# EAGLE design dac-eval (EAGLE 7.3.0)
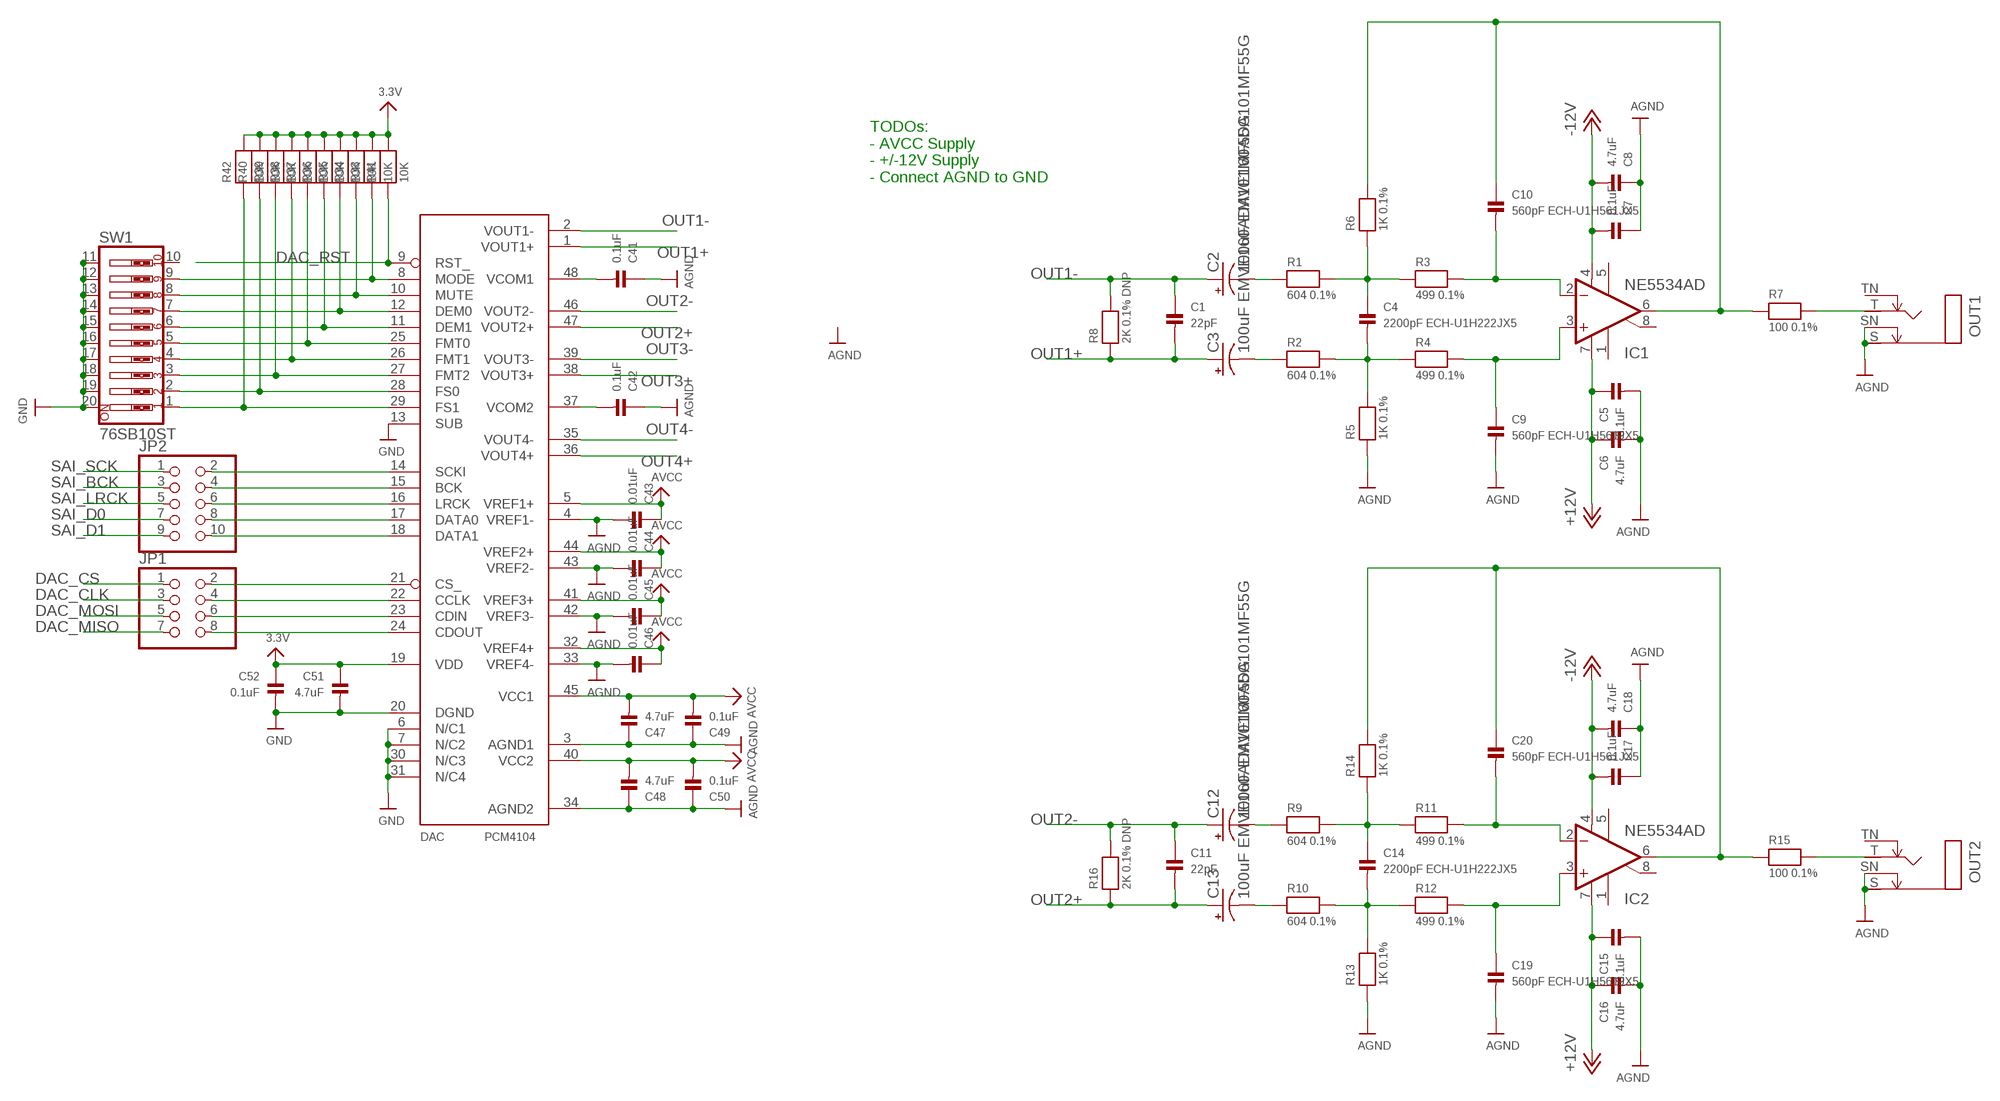
[diagram p0: schematic, sheet 1, part 1 of 2]
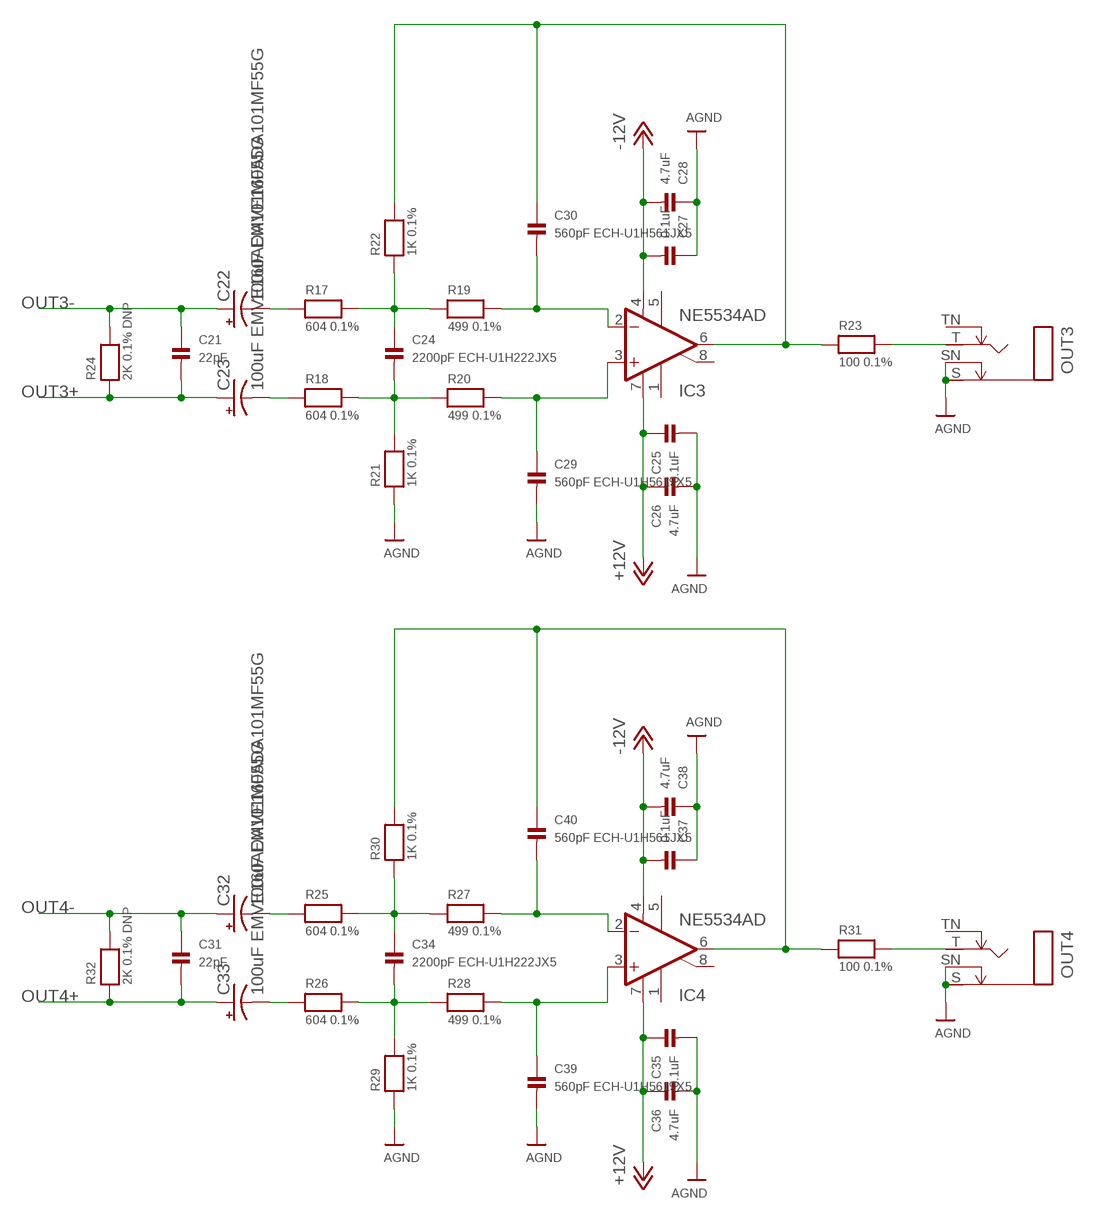
[diagram p1: schematic, sheet 1, part 2 of 2]

## Parts
C1  22pF  CAP_CERAMIC0603  [0603]
C2  100uF EMVE160ADA101MF55G  CAP_POLD  [PANASONIC_D]
C3  100uF EMVE160ADA101MF55G  CAP_POLD  [PANASONIC_D]
C4  2200pF ECH-U1H222JX5  CAP_CERAMIC0805  [0805]
C5  0.1uF  CAP_CERAMIC0603  [0603]
C6  4.7uF  CAP_CERAMIC0603  [0603]
C7  0.1uF  CAP_CERAMIC0603  [0603]
C8  4.7uF  CAP_CERAMIC0603  [0603]
C9  560pF ECH-U1H561JX5  CAP_CERAMIC0805  [0805]
C10  560pF ECH-U1H561JX5  CAP_CERAMIC0805  [0805]
C11  22pF  CAP_CERAMIC0603  [0603]
C12  100uF EMVE160ADA101MF55G  CAP_POLD  [PANASONIC_D]
C13  100uF EMVE160ADA101MF55G  CAP_POLD  [PANASONIC_D]
C14  2200pF ECH-U1H222JX5  CAP_CERAMIC0805  [0805]
C15  0.1uF  CAP_CERAMIC0603  [0603]
C16  4.7uF  CAP_CERAMIC0603  [0603]
C17  0.1uF  CAP_CERAMIC0603  [0603]
C18  4.7uF  CAP_CERAMIC0603  [0603]
C19  560pF ECH-U1H561JX5  CAP_CERAMIC0805  [0805]
C20  560pF ECH-U1H561JX5  CAP_CERAMIC0805  [0805]
C21  22pF  CAP_CERAMIC0603  [0603]
C22  100uF EMVE160ADA101MF55G  CAP_POLD  [PANASONIC_D]
C23  100uF EMVE160ADA101MF55G  CAP_POLD  [PANASONIC_D]
C24  2200pF ECH-U1H222JX5  CAP_CERAMIC0805  [0805]
C25  0.1uF  CAP_CERAMIC0603  [0603]
C26  4.7uF  CAP_CERAMIC0603  [0603]
C27  0.1uF  CAP_CERAMIC0603  [0603]
C28  4.7uF  CAP_CERAMIC0603  [0603]
C29  560pF ECH-U1H561JX5  CAP_CERAMIC0805  [0805]
C30  560pF ECH-U1H561JX5  CAP_CERAMIC0805  [0805]
C31  22pF  CAP_CERAMIC0603  [0603]
C32  100uF EMVE160ADA101MF55G  CAP_POLD  [PANASONIC_D]
C33  100uF EMVE160ADA101MF55G  CAP_POLD  [PANASONIC_D]
C34  2200pF ECH-U1H222JX5  CAP_CERAMIC0805  [0805]
C35  0.1uF  CAP_CERAMIC0603  [0603]
C36  4.7uF  CAP_CERAMIC0603  [0603]
C37  0.1uF  CAP_CERAMIC0603  [0603]
C38  4.7uF  CAP_CERAMIC0603  [0603]
C39  560pF ECH-U1H561JX5  CAP_CERAMIC0805  [0805]
C40  560pF ECH-U1H561JX5  CAP_CERAMIC0805  [0805]
C41  0.1uF  CAP_CERAMIC0603  [0603]
C42  0.1uF  CAP_CERAMIC0603  [0603]
C43  0.01uF  CAP_CERAMIC0603  [0603]
C44  0.01uF  CAP_CERAMIC0603  [0603]
C45  0.01uF  CAP_CERAMIC0603  [0603]
C46  0.01uF  CAP_CERAMIC0603  [0603]
C47  4.7uF  CAP_CERAMIC0603  [0603]
C48  4.7uF  CAP_CERAMIC0603  [0603]
C49  0.1uF  CAP_CERAMIC0603  [0603]
C50  0.1uF  CAP_CERAMIC0603  [0603]
C51  4.7uF  CAP_CERAMIC0603  [0603]
C52  0.1uF  CAP_CERAMIC0603  [0603]
DAC  PCM4104  [SQFP-S-7X7-48]
IC1  NE5534AD  [SO08]
IC2  NE5534AD  [SO08]
IC3  NE5534AD  [SO08]
IC4  NE5534AD  [SO08]
JP1  PINHD-2X4  [2X04]
JP2  PINHD-2X5  [2X05]
OUT1  NMJ4HFD2  MONOSWS  [NMJ4HC-S]
OUT2  NMJ4HFD2  MONOSWS  [NMJ4HC-S]
OUT3  NMJ4HFD2  MONOSWS  [NMJ4HC-S]
OUT4  NMJ4HFD2  MONOSWS  [NMJ4HC-S]
R1  604 0.1%  RESISTOR0603  [0603]
R2  604 0.1%  RESISTOR0603  [0603]
R3  499 0.1%  RESISTOR0603  [0603]
R4  499 0.1%  RESISTOR0603  [0603]
R5  1K 0.1%  RESISTOR0603  [0603]
R6  1K 0.1%  RESISTOR0603  [0603]
R7  100 0.1%  RESISTOR0603  [0603]
R8  2K 0.1% DNP  RESISTOR0603  [0603]
R9  604 0.1%  RESISTOR0603  [0603]
R10  604 0.1%  RESISTOR0603  [0603]
R11  499 0.1%  RESISTOR0603  [0603]
R12  499 0.1%  RESISTOR0603  [0603]
R13  1K 0.1%  RESISTOR0603  [0603]
R14  1K 0.1%  RESISTOR0603  [0603]
R15  100 0.1%  RESISTOR0603  [0603]
R16  2K 0.1% DNP  RESISTOR0603  [0603]
R17  604 0.1%  RESISTOR0603  [0603]
R18  604 0.1%  RESISTOR0603  [0603]
R19  499 0.1%  RESISTOR0603  [0603]
R20  499 0.1%  RESISTOR0603  [0603]
R21  1K 0.1%  RESISTOR0603  [0603]
R22  1K 0.1%  RESISTOR0603  [0603]
R23  100 0.1%  RESISTOR0603  [0603]
R24  2K 0.1% DNP  RESISTOR0603  [0603]
R25  604 0.1%  RESISTOR0603  [0603]
R26  604 0.1%  RESISTOR0603  [0603]
R27  499 0.1%  RESISTOR0603  [0603]
R28  499 0.1%  RESISTOR0603  [0603]
R29  1K 0.1%  RESISTOR0603  [0603]
R30  1K 0.1%  RESISTOR0603  [0603]
R31  100 0.1%  RESISTOR0603  [0603]
R32  2K 0.1% DNP  RESISTOR0603  [0603]
R33  10K  RESISTOR0603  [0603]
R34  10K  RESISTOR0603  [0603]
R35  10K  RESISTOR0603  [0603]
R36  10K  RESISTOR0603  [0603]
R37  10K  RESISTOR0603  [0603]
R38  10K  RESISTOR0603  [0603]
R39  10K  RESISTOR0603  [0603]
R40  10K  RESISTOR0603  [0603]
R41  10K  RESISTOR0603  [0603]
R42  10K  RESISTOR0603  [0603]
SW1  76SB10ST  SW_DIP-10  [EDG-10]

## Nets
3.3V: C51.1 C52.1 DAC.19(VDD) R33.2 R34.2 R35.2 R36.2 R37.2 R38.2 R39.2 R40.2 R41.2 R42.2
+12V: C5.1 C6.1 C15.1 C16.1 C25.1 C26.1 C35.1 C36.1 IC1.7(V+) IC2.7(V+) IC3.7(V+) IC4.7(V+)
-12V: C7.2 C8.2 C17.2 C18.2 C27.2 C28.2 C37.2 C38.2 IC1.4(V-) IC2.4(V-) IC3.4(V-) IC4.4(V-)
AGND: C5.2 C6.2 C7.1 C8.1 C9.2 C15.2 C16.2 C17.1 C18.1 C19.2 C25.2 C26.2 C27.1 C28.1 C29.2 C35.2 C36.2 C37.1 C38.1 C39.2 C41.1 C42.1 C43.2 C44.2 C45.2 C46.2 C47.1 C48.1 C49.1 C50.1 DAC.3(AGND1) DAC.4(VREF1-) DAC.33(VREF4-) DAC.34(AGND2) DAC.42(VREF3-) DAC.43(VREF2-) OUT1.S OUT1.SN OUT2.S OUT2.SN OUT3.S OUT3.SN OUT4.S OUT4.SN R5.1 R13.1 R21.1 R29.1
AVCC: C43.1 C44.1 C45.1 C46.1 C47.2 C48.2 C49.2 C50.2 DAC.5(VREF1+) DAC.32(VREF4+) DAC.40(VCC2) DAC.41(VREF3+) DAC.44(VREF2+) DAC.45(VCC1)
DAC_CLK: JP1.3
DAC_CS: JP1.1
DAC_MISO: JP1.7
DAC_MOSI: JP1.5
DAC_RST: DAC.9(RST_) R41.1
GND: C51.2 C52.2 DAC.6(N/C1) DAC.7(N/C2) DAC.13(SUB) DAC.20(DGND) DAC.30(N/C3) DAC.31(N/C4) SW1.11 SW1.12 SW1.13 SW1.14 SW1.15 SW1.16 SW1.17 SW1.18 SW1.19 SW1.20
N$1: C12.- R9.1
N$2: C13.- R10.1
N$3: C2.- R1.1
N$4: C3.- R2.1
N$5: C4.2 R2.2 R4.1 R5.2
N$6: C4.1 R1.2 R3.1 R6.1
N$7: C14.2 R10.2 R12.1 R13.2
N$8: C9.1 IC1.3(+IN) R4.2
N$9: C10.2 IC1.2(-IN) R3.2
N$10: C10.1 IC1.6(OUT) R6.2 R7.1
N$11: C14.1 R9.2 R11.1 R14.1
N$12: OUT1.T R7.2
N$13: C19.1 IC2.3(+IN) R12.2
N$14: C20.2 IC2.2(-IN) R11.2
N$15: C20.1 IC2.6(OUT) R14.2 R15.1
N$16: OUT2.T R15.2
N$17: C22.- R17.1
N$18: C23.- R18.1
N$19: C24.2 R18.2 R20.1 R21.2
N$20: C24.1 R17.2 R19.1 R22.1
N$21: C29.1 IC3.3(+IN) R20.2
N$22: C30.2 IC3.2(-IN) R19.2
N$23: C30.1 IC3.6(OUT) R22.2 R23.1
N$24: OUT3.T R23.2
N$25: C32.- R25.1
N$26: C33.- R26.1
N$27: C34.2 R26.2 R28.1 R29.2
N$28: C34.1 R25.2 R27.1 R30.1
N$29: C39.1 IC4.3(+IN) R28.2
N$30: C40.2 IC4.2(-IN) R27.2
N$31: C40.1 IC4.6(OUT) R30.2 R31.1
N$32: OUT4.T R31.2
N$33: C41.2 DAC.48(VCOM1)
N$34: C42.2 DAC.37(VCOM2)
N$35: DAC.21(CS_) JP1.2
N$36: DAC.22(CCLK) JP1.4
N$37: DAC.23(CDIN) JP1.6
N$38: DAC.24(CDOUT) JP1.8
N$39: DAC.14(SCKI) JP2.2
N$40: DAC.15(BCK) JP2.4
N$41: DAC.16(LRCK) JP2.6
N$42: DAC.17(DATA0) JP2.8
N$43: DAC.18(DATA1) JP2.10
N$44: DAC.29(FS1) R42.1 SW1.1
N$45: DAC.28(FS0) R40.1 SW1.2
N$46: DAC.27(FMT2) R39.1 SW1.3
N$47: DAC.26(FMT1) R38.1 SW1.4
N$48: DAC.25(FMT0) R37.1 SW1.5
N$49: DAC.11(DEM1) R36.1 SW1.6
N$50: DAC.12(DEM0) R35.1 SW1.7
N$51: DAC.10(MUTE) R34.1 SW1.8
N$52: DAC.8(MODE) R33.1 SW1.9
OUT1+: C1.2 C3.+ DAC.1(VOUT1+) R8.1
OUT1-: C1.1 C2.+ DAC.2(VOUT1-) R8.2
OUT2+: C11.2 C13.+ DAC.47(VOUT2+) R16.1
OUT2-: C11.1 C12.+ DAC.46(VOUT2-) R16.2
OUT3+: C21.2 C23.+ DAC.38(VOUT3+) R24.1
OUT3-: C21.1 C22.+ DAC.39(VOUT3-) R24.2
OUT4+: C31.2 C33.+ DAC.36(VOUT4+) R32.1
OUT4-: C31.1 C32.+ DAC.35(VOUT4-) R32.2
SAI_BCK: JP2.3
SAI_D0: JP2.7
SAI_D1: JP2.9
SAI_LRCK: JP2.5
SAI_SCK: JP2.1
Unconnected: IC1.1(ON) IC1.5(CMP) IC1.8(ON/CMP) IC2.1(ON) IC2.5(CMP) IC2.8(ON/CMP) IC3.1(ON) IC3.5(CMP) IC3.8(ON/CMP) IC4.1(ON) IC4.5(CMP) IC4.8(ON/CMP) OUT1.TN OUT2.TN OUT3.TN OUT4.TN SW1.10

## Notes on the sheet
- TODOs:
  - AVCC Supply
  - +/-12V Supply
  - Connect AGND to GND

## Library data of the parts
C1 C4-C11 C14-C21 C24-C31 C34-C52 = microbuilder:CAP_CERAMIC: Ceramic Capacitors 0402 - 0402 Surface Mount Capacitors 16pF 50V 5% [Digikey: 445-4899-2-ND] 18pF 50V 5% [Digikey: 490-1281-2-ND] 22pF 50V 5% [Digikey: 490-1283-2-ND] 68pF 50V 5% [Digikey: 490-1289-2-ND] 0.1uF 10V 10% [Digikey: 490-1318-2-ND] 1.0uF 6.3V 10% [Digikey: 490-1320-2-ND] 0603 - 0603 Surface Mount Capacitors 16 pF 50V 5% [Digikey: 445-5051-2-ND] 22 pF 50V [Digikey: PCC220ACVTR-ND] 33 pF 50V 5% [Digikey: 490-1415-1-ND] 56pF 50V 5% [Digikey: 490-1421-1-ND] 220pF 50V 5% [Digikey: 445-1285-1-ND] 680 pF 50V 2200 pF 50V 5% C0G [Digikey: 445-1297-1-ND] 5600 pF 100V 5% X7R [Digikey: 478-3711-1-ND] 0.1 µF 25V 10% [Digikey: PCC2277TR-ND] 0.22 µF 16V 10% X7R [Digikey: 445-1318-1-ND] 1.0 µF 25V 10% [Digikey: 445-5146-2-ND] 0603 - RF Specific 3pF 250V +/-0.1pF RF [Digikey: 712-1347-1-ND] 18 pF 250V 5% [Digikey: 478-3505-1-ND or 712-1322-1-ND] 56 pF 250V 5% C0G RF [Digikey: 490-4867-1-ND] 68 pF 250V RF [Digikey: 490-4868-1-ND] 0805 - 0805 Surface Mount Capacitors 220 pF 250V 2% RF Ceramic Capacitor [Digikey: 712-1398-1-ND] 1000 pF 50V 2% NP0 Ceramic Capacitor [Digikey: 478-3760-1-ND] 0.1 µF 25V 10% Ceramic Capacitor [Digikey: PCC1828TR-ND] 1.0 µF 16V 10% Ceramic Capacitor[Digikey: 490-1691-2-ND] 10.0 µF 10V 10% Ceramic Capacitor[Digikey: 709-1228-1-ND] 10.0 uF 16V 10% Ceramic Capacitor [Digikey: 478-5165-2-ND] 47 uF 6.3V 20% Ceramic Capacitor [Digikey: 587-1779-1-ND or 399-5506-1-ND] 1206 - 1206 Surface Mount Capacitors 47uF 10V 20% Ceramic Capacitor [Digikey: 490-5528-1-ND or 399-5508-1-ND or 445-6010-1-ND] 100uF 6.3V -20%, +80% Y5V Ceramic Capacitor (Digikey: 490-4512-1-ND, Mouser: 81-GRM31CF50J107ZE1L)
C2 C3 C12 C13 C22 C23 C32 C33 = SparkFun-Capacitors:CAP_POL: Capacitor Polarized These are standard SMD and PTH capacitors. Normally 10uF, 47uF, and 100uF in electrolytic and tantalum varieties. Always verify the external diameter of the through hole cap, it varies with capacity, voltage, and manufacturer. The EIA devices should be standard.
DAC = BurrBrownAudioParts:PCM4104: PCM4104: High-Performance 118dB, 24-Bit, 216kHz Sampling, Four-Channel Audio D/A Converter
IC1-IC4 = linear:NE5534: LOW-NOISE OPERATIONAL AMPLIFIER Source: http://focus.ti.com/lit/ds/symlink/ne5534.pdf
JP1 = pinhead:PINHD-2X4: PIN HEADER
JP2 = pinhead:PINHD-2X5: PIN HEADER
OUT1-OUT4 = pl-jacks:MONOSW
R1-R42 = microbuilder:RESISTOR: Resistors 0402 - 0402 Surface Mount Package 22 Ohm 1% 1/16W [Digikey: 311-22.0LRTR-ND] 33 Ohm 5% 1/16W 1.0K 5% 1/16W 1.5K 5% 1/16W 2.0K 1% 1/16W 10.0K 1% 1/16W [Digikey: 311-10.0KLRTR-ND] 10.0K 5% 1/16W [Digikey: RMCF0402JT10K0TR-ND] 12.1K 1% 1/16W [Digikey: 311-22.0LRTR-ND] 100.0K 5% 1/16W 0603 - 0603 Surface Mount Package 0 Ohm 1/10 Watt 1% Resistor 15 Ohm 1/10 Watt 1% Resistor 33 Ohm 1/10 Watt 1% Resistor 49.9 Ohm 1/10 Watt 1% Resistor 100 Ohm 1/10 Watt 1% Resistor 150 Ohm 1/10 Watt 1% Resistor 240 Ohm 1/10 Watt 1% Resistor 390 Ohm 1/10 Watt 1% Resistor 560 Ohm 1/10 Watt 1% Resistor 680 Ohm 1/10 Watt 1% Resistor 750 Ohm 1/10 Watt 1% Resistor 1.0K Ohm 1/10 Watt 1% Resistor 1.5K Ohm 1/10 Watt 1% Resistor 2.0K Ohm 1/10 Watt 1% Resistor 2.2K Ohm 1/10 Watt 1% Resistor 3.3K Ohm 1/10 Watt 1% Resistor 4.7K Ohm 1/10 Watt 1% Resistor 10.0K Ohm 1/10 Watt 1% Resistor 12.0K Ohm 1/10 Watt 1% Resistor 12.1K Ohm 1/10 Watt 1% Resistor 20.0K Ohm 1/10 Watt 1% Resistor 33.0K Ohm 1/10 Watt 1% Resistor 100.0K Ohm 1/10 Watt 1% Resistor 0805 - 0805 Surface Mount Package 0 Ohm 1/8 Watt 1% Resistor 33 Ohm 1/8 Watt 1% Resistor 100 Ohm 1/8 Watt 1% Resistor 150 Ohm 1/8 Watt 1% Resistor 200 Ohm 1/8 Watt 1% Resistor 240 Ohm 1/8 Watt 1% Resistor 330 Ohm 1/8 Watt 1% Resistor 390 Ohm 1/8 Watt 1% Resistor 470 Ohm 1/8 Watt 1% Resistor 1.0K Ohm 1/8 Watt 1% Resistor 1.5K Ohm 1/8 Watt 1% Resistor 2.0K Ohm 1/8 Watt 1% Resistor 4.7K Ohm 1/8 Watt 1% Resistor 5.1K Ohm 1/8 Watt 1% Resistor 5.6K Ohm 1/8 Watt 1% Resistor 10.0K Ohm 1/8 Watt 1% Resistor 22.0K Ohm 1/8 Watt 1% Resistor 33.0K Ohm 1/8 Watt 1% Resistor 100K Ohm 1/8 Watt 1% Resistor 1206 - 1206 Surface Mount Package 2012 - 2010 Surface Mount Package 0.11 Ohm 1/2 Watt 1% Resistor - Digikey: RHM.11UCT-ND
SW1 = special:SW_DIP-10: DIP SWITCH

## Board
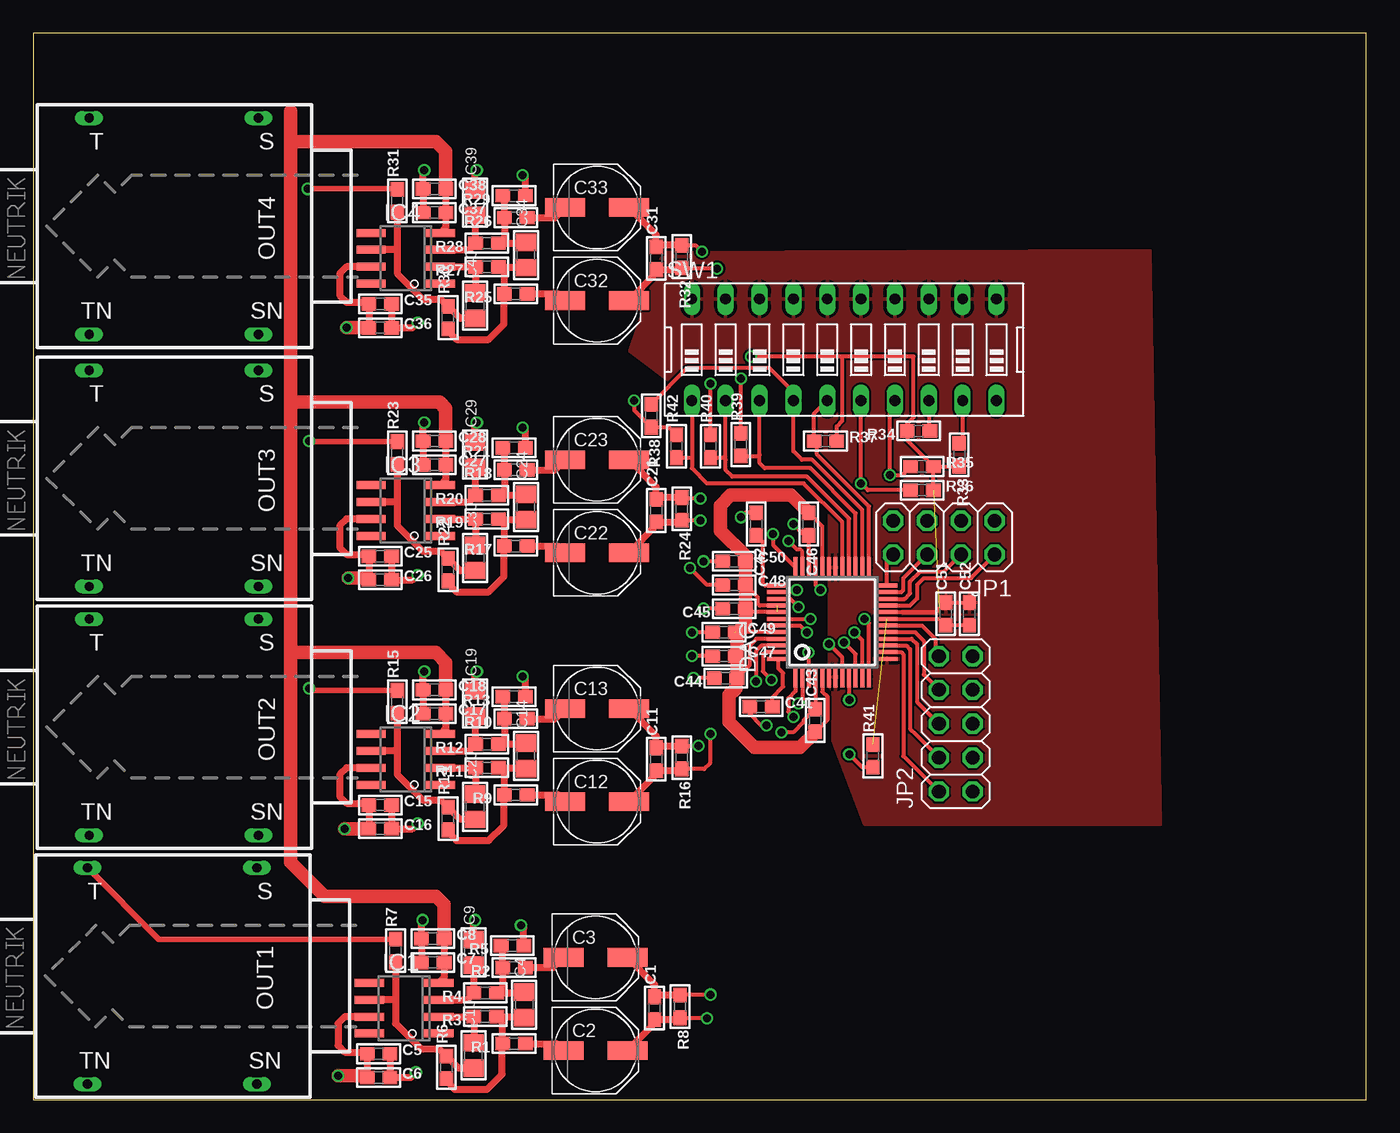
[diagram p2: board, top side]
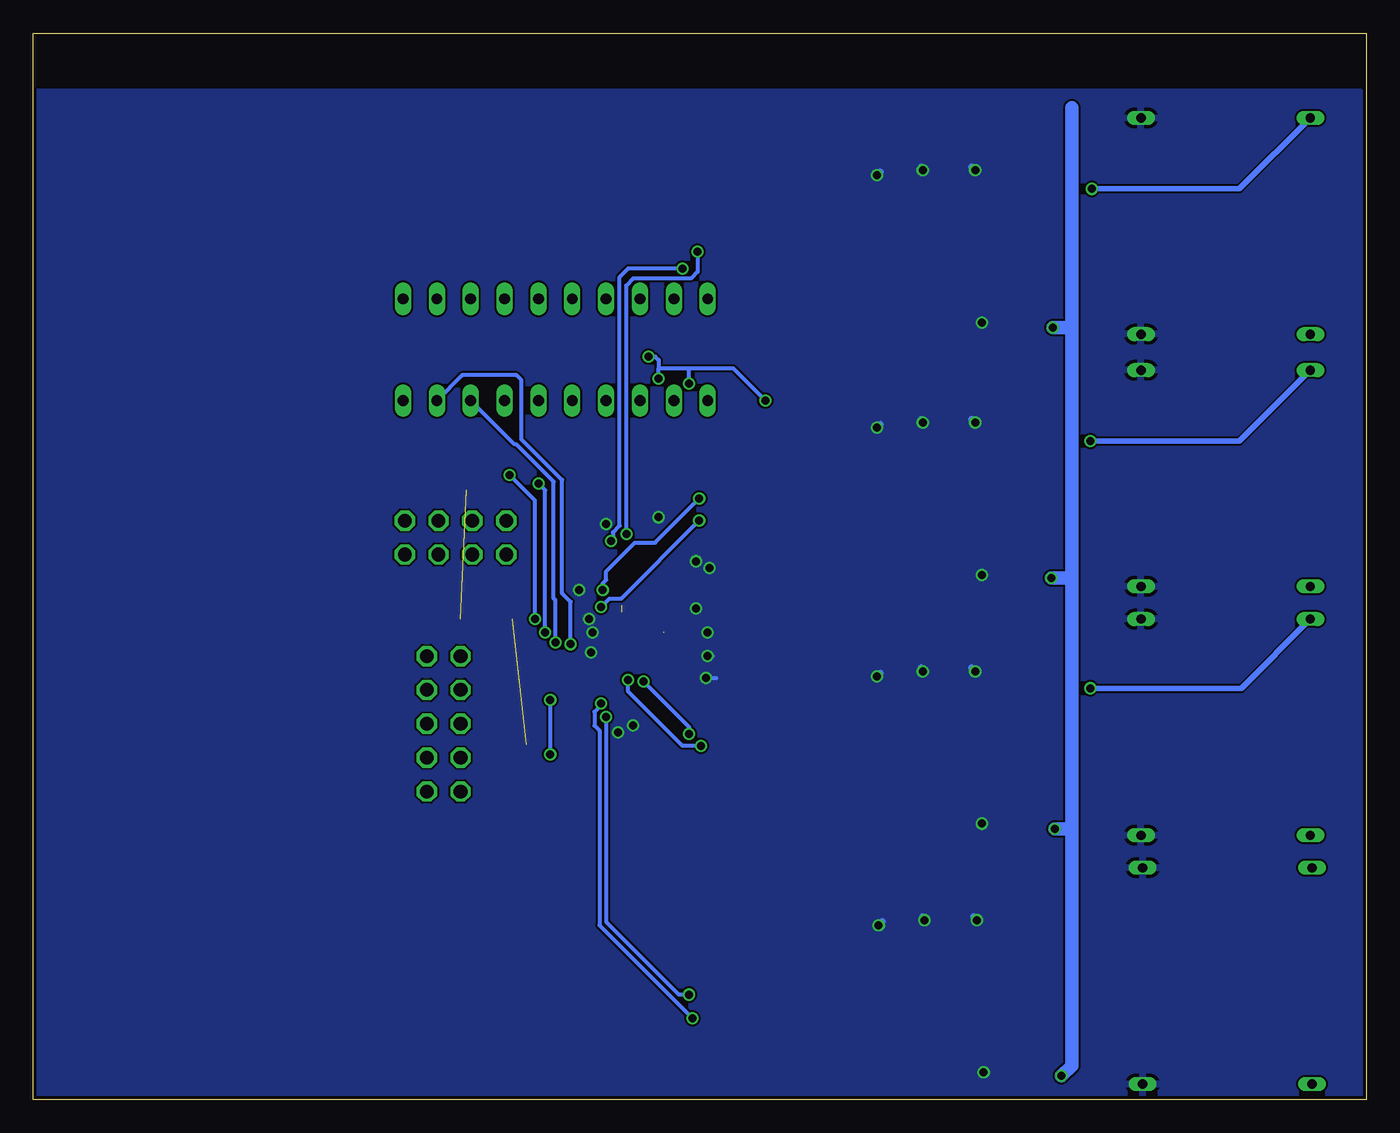
[diagram p3: board, bottom side, seen from below]

Size 100 x 80 mm. Coordinates in mm from the lower left corner, seen from the top.
Outline: 0,0 100,0 100,80 0,80 0,0
Copper layers (1*16): Top 0.035mm / dielectric 1.5mm / Bottom 0.035mm
Design rules "MacroFab_Standard_2_Layer *": minimum track width 6mil, minimum drill 12mil, track to track 6mil, track to pad 6mil, pad to pad 6mil, via to via 6mil, smd to smd 0mil, copper to edge 10mil, drill to drill 10mil, minimum pad ring 6mil, minimum via ring 6mil, stop-mask expansion 2mil, vias tented up to drill 25mil, thermal gap 10mil

### Footprints (pad centres in the part's own frame; a part is rotated, then mirrored left to right if it is on the bottom)
0603 = smd 1.1 x 1: 1 -0.85,0; 2 0.85,0
PANASONIC_D = smd 3 x 1.4: + 2.4,0; - -2.4,0
0805 = smd 1.3 x 1.5: 1 -0.95,0; 2 0.95,0
SQFP-S-7X7-48 = smd 0.3 x 1.6: 1 -2.75,-4.1; 2 -2.25,-4.1; 3 -1.75,-4.1; 4 -1.25,-4.1; 5 -0.75,-4.1; 6 -0.25,-4.1; 7 0.25,-4.1; 8 0.75,-4.1; 9 1.25,-4.1; 10 1.75,-4.1; 11 2.25,-4.1; 12 2.75,-4.1; 25 2.75,4.1; 26 2.25,4.1; 27 1.75,4.1; 28 1.25,4.1; 29 0.75,4.1; 30 0.25,4.1; 31 -0.25,4.1; 32 -0.75,4.1; 33 -1.25,4.1; 34 -1.75,4.1; 35 -2.25,4.1; 36 -2.75,4.1 | smd 1.6 x 0.3: 13 4.1,-2.75; 14 4.1,-2.25; 15 4.1,-1.75; 16 4.1,-1.25; 17 4.1,-0.75; 18 4.1,-0.25; 19 4.1,0.25; 20 4.1,0.75; 21 4.1,1.25; 22 4.1,1.75; 23 4.1,2.25; 24 4.1,2.75; 37 -4.1,2.75; 38 -4.1,2.25; 39 -4.1,1.75; 40 -4.1,1.25; 41 -4.1,0.75; 42 -4.1,0.25; 43 -4.1,-0.25; 44 -4.1,-0.75; 45 -4.1,-1.25; 46 -4.1,-1.75; 47 -4.1,-2.25; 48 -4.1,-2.75
SO08 = smd 0.6 x 2.2: 1 -1.905,-2.6; 2 -0.635,-2.6; 3 0.635,-2.6; 4 1.905,-2.6; 5 1.905,2.6; 6 0.635,2.6; 7 -0.635,2.6; 8 -1.905,2.6
2X04 = drill 1.016 octagon: 1 -3.81,-1.27; 2 -3.81,1.27; 3 -1.27,-1.27; 4 -1.27,1.27; 5 1.27,-1.27; 6 1.27,1.27; 7 3.81,-1.27; 8 3.81,1.27
2X05 = drill 1.016 octagon: 1 -5.08,-1.27; 2 -5.08,1.27; 3 -2.54,-1.27; 4 -2.54,1.27; 5 0,-1.27; 6 0,1.27; 7 2.54,-1.27; 8 2.54,1.27; 9 5.08,-1.27; 10 5.08,1.27
NMJ4HC-S = drill 0.7 long: S 5.08,8.115; SN 5.08,-8.115; T -7.62,8.115; TN -7.62,-8.115
EDG-10 = drill 0.813 long: 1 -11.43,-3.81; 2 -8.89,-3.81; 3 -6.35,-3.81; 4 -3.81,-3.81; 5 -1.27,-3.81; 6 1.27,-3.81; 7 3.81,-3.81; 8 6.35,-3.81; 9 8.89,-3.81; 10 11.43,-3.81; 11 11.43,3.81; 12 8.89,3.81; 13 6.35,3.81; 14 3.81,3.81; 15 1.27,3.81; 16 -1.27,3.81; 17 -3.81,3.81; 18 -6.35,3.81; 19 -8.89,3.81; 20 -11.43,3.81

### Placement (x,y rotation side)
C1  46.61,6.86 90 top
C2  42.16,3.68 0 top
C3  42.16,10.67 0 top
C4  36.83,7.11 90 top
C5  25.91,3.43 0 top
C6  25.91,1.65 0 top
C7  29.97,10.29 0 top
C8  29.97,12.06 0 top
C9  33.02,11.05 90 top
C10  33.02,3.3 90 top
C11  46.74,25.53 90 top
C12  42.29,22.35 0 top
C13  42.29,29.34 0 top
C14  36.96,25.78 90 top
C15  26.04,22.1 0 top
C16  26.04,20.32 0 top
C17  30.1,28.96 0 top
C18  30.1,30.73 0 top
C19  33.15,29.72 90 top
C20  33.15,21.97 90 top
C21  46.74,44.2 90 top
C22  42.29,41.02 0 top
C23  42.29,48.01 0 top
C24  36.96,44.45 90 top
C25  26.04,40.77 0 top
C26  26.04,38.99 0 top
C27  30.1,47.62 0 top
C28  30.1,49.4 0 top
C29  33.15,48.39 90 top
C30  33.15,40.64 90 top
C31  46.74,63.12 90 top
C32  42.29,59.94 0 top
C33  42.29,66.93 0 top
C34  36.96,63.37 90 top
C35  26.04,59.69 0 top
C36  26.04,57.91 0 top
C37  30.1,66.55 0 top
C38  30.1,68.33 0 top
C39  33.15,67.31 90 top
C40  33.15,59.56 90 top
C41  54.61,29.46 0 top
C42  54.23,43.18 270 top
C43  58.67,28.45 90 top
C44  51.94,31.62 180 top
C45  52.58,36.83 180 top
C46  58.17,43.18 270 top
C47  51.82,33.27 0 top
C48  52.58,38.61 0 top
C49  51.82,35.05 0 top
C50  52.58,40.39 0 top
C51  68.45,36.45 90 top
C52  70.23,36.45 90 top
DAC  59.94,35.81 0 top
IC1  27.81,6.86 90 top
IC2  27.94,25.53 90 top
IC3  27.94,44.2 90 top
IC4  27.94,63.12 90 top
JP1  68.33,42.16 180 top
JP2  69.22,28.19 90 top
OUT1  11.68,9.27 0 top
OUT2  11.81,27.94 0 top
OUT3  11.81,46.61 0 top
OUT4  11.81,65.53 0 top
R1  36.07,4.19 180 top
R2  36.07,9.91 180 top
R3  33.91,6.22 180 top
R4  33.91,8 180 top
R5  35.94,11.56 180 top
R6  30.99,2.41 90 top
R7  27.18,11.18 90 top
R8  48.51,6.99 270 top
R9  36.2,22.86 180 top
R10  36.2,28.57 180 top
R11  34.04,24.89 180 top
R12  34.04,26.67 180 top
R13  36.07,30.23 180 top
R14  31.11,21.08 90 top
R15  27.3,29.84 90 top
R16  48.64,25.65 270 top
R17  36.2,41.53 180 top
R18  36.2,47.24 180 top
R19  34.04,43.56 180 top
R20  34.04,45.34 180 top
R21  36.07,48.9 180 top
R22  31.11,39.75 90 top
R23  27.3,48.51 90 top
R24  48.64,44.32 270 top
R25  36.2,60.45 180 top
R26  36.2,66.17 180 top
R27  34.04,62.48 180 top
R28  34.04,64.26 180 top
R29  36.07,67.82 180 top
R30  31.11,58.67 90 top
R31  27.3,67.44 90 top
R32  48.64,63.25 270 top
R33  69.47,48.39 270 top
R34  66.42,50.16 180 top
R35  66.67,47.5 0 top
R36  66.67,45.72 0 top
R37  59.44,49.4 0 top
R38  46.35,51.31 270 top
R39  53.09,49.15 90 top
R40  50.8,49.02 90 top
R41  62.99,25.78 90 top
R42  48.26,49.02 90 top
SW1  60.83,56.26 0 top

### Tracks (layer width: path | path; a pad name or v marks a point on that pad's centre or on a via)
3.3V  (via drill 0.6)  (2 unrouted)
  Top 0.305: C52.1 C51.1 67.99,36.06 DAC.19 | R39.2 v53.09,54.1 | v45.09,52.45 45.09,51.73 R38.2 47.67,50.46 R42.2 | R40.2 v50.8,53.72 | R37.2 60.29,50.51 60.71,50.93 60.71,55.75 | 60.71,55.75 66.04,55.75 66.04,51.18 65.57,50.71 R34.2 65.57,49.45 R35.2 | 60.71,55.75 v53.85,55.75 | R35.2 69.43,47.5 R33.2 | R36.2 R35.2
  Bottom 0.305: v53.09,54.1 53.09,54.86 | 53.09,54.86 50.8,54.86 | 50.8,54.86 47.5,54.86 v45.09,52.45 | v50.8,53.72 50.8,54.86 | v53.85,55.75 53.34,55.75 53.09,55.5 53.09,54.86
+12V  (via drill 0.6)
  Top 0.508: IC1.7 23.37,6.22 22.86,5.71 22.86,4.06 23.37,3.56 24.93,3.56 C5.1 C6.1 | IC4.7 23.5,62.48 22.99,61.98 22.99,60.33 23.5,59.82 25.06,59.82 C35.1 C36.1 | IC3.7 23.5,43.56 22.99,43.05 22.99,41.4 23.5,40.89 25.06,40.89 C25.1 C26.1 | IC2.7 23.5,24.89 22.99,24.38 22.99,22.73 23.5,22.23 25.06,22.23 C15.1 C16.1
  Top 1.016: v22.86,1.78 24.93,1.78 C6.1 | C16.1 v23.37,20.32 | v23.62,39.12 25.06,39.12 C26.1 | C36.1 v23.5,57.91
  Bottom 1.016: 22.1,74.42 22.1,57.91 | 22.1,57.91 22.1,39.12 | 22.1,39.12 22.1,20.32 | 22.1,20.32 22.1,2.54 v22.86,1.78 | v23.37,20.32 22.1,20.32 | v23.62,39.12 22.1,39.12 | v23.5,57.91 22.1,57.91
-12V
  Top 0.508: C8.2 C7.2 30.82,9.17 IC1.4 | C38.2 C37.2 30.95,65.43 IC4.4 | C28.2 C27.2 30.95,46.51 IC3.4 | C18.2 C17.2 30.95,27.84 IC2.4
  Top 1.016: C8.2 30.82,14.64 30.23,15.24 21.84,15.24 19.3,17.78 19.3,33.53 | 19.3,33.53 19.3,52.32 | 19.3,52.32 19.3,71.88 | 19.3,71.88 19.3,74.17 | C38.2 30.95,71.16 30.23,71.88 19.3,71.88 | 19.3,52.32 30.48,52.32 30.95,51.85 C28.2 | 19.3,33.53 30.23,33.53 30.95,32.8 C18.2
AGND  (via drill 0.6)
  Top 0.305: C43.2 58.69,29.32 DAC.4 58.69,29.36 57.78,28.45 57.78,28.32 57.02,27.56 v56.13,27.56 | DAC.34 58.19,42.3 C46.2 57.87,42.33 v57.02,43.18 | DAC.33 58.69,38.59 v59.05,38.23 | DAC.42 v58.29,36.06 v58.29,36.07 | DAC.43 57.53,35.56 v58.04,35.05 | C42.1 53.43,44.03 v53.09,43.69 | C50.1 v50.29,40.39 | C48.1 50.55,38.61 v49.28,39.88 | C45.2 v50.29,36.83 | C49.1 v49.4,35.05 | C47.1 v49.4,33.27 | C44.2 v49.53,31.62 | C41.1 53.76,28.92 54.61,28.07 v54.99,28.07 | DAC.3 58.19,33.5 v58.17,33.53
  Top 0.508: C7.1 C8.1 29.12,13.37 v29.21,13.46 | C5.2 C6.2 28.32,1.65 v28.7,2.03 | R5.1 36.79,12.87 v36.58,13.08 | C9.2 33.02,13.34 v33.15,13.46 | C37.1 C38.1 29.25,69.64 v29.34,69.72 | C35.2 C36.2 28.45,57.91 v28.83,58.29 | R29.1 36.92,69.13 v36.7,69.34 | C39.2 33.15,69.6 v33.27,69.72 | C27.1 C28.1 29.25,50.71 v29.34,50.8 | C25.2 C26.2 28.45,38.99 v28.83,39.37 | R21.1 36.92,50.2 v36.7,50.42 | C29.2 33.15,50.67 v33.27,50.8 | C17.1 C18.1 29.25,32.04 v29.34,32.13 | C15.2 C16.2 28.45,20.32 v28.83,20.7 | R13.1 36.92,31.54 v36.7,31.75 | C19.2 33.15,32 v33.27,32.13
  Bottom 0.305: v59.05,38.23 59.18,38.1 | v58.29,36.07 58.42,36.07 | v58.04,35.05 58.17,34.92 | 56.77,43.05 56.77,43.18 | v53.09,43.69 52.83,43.43 | v50.29,40.39 50.04,40.39 | v50.29,36.83 50.04,36.83 | v49.4,35.05 49.15,35.05 | v49.4,33.27 49.02,33.27 | v49.53,31.62 48.77,31.62 | v54.99,28.07 55.24,28.07 | v58.17,33.53 58.17,33.78
  Bottom 0.508: v28.7,2.03 28.83,2.16 | v29.21,13.46 29.46,13.72 | v36.58,13.08 36.32,13.34 | v33.15,13.46 33.15,13.59 33.27,13.72 | v28.83,58.29 28.96,58.42 | v29.34,69.72 29.59,69.98 | v36.7,69.34 36.45,69.6 | v33.27,69.72 33.27,69.85 33.4,69.98 | v28.83,39.37 28.96,39.5 | v29.34,50.8 29.59,51.05 | v36.7,50.42 36.45,50.67 | v33.27,50.8 33.27,50.93 33.4,51.05 | v28.83,20.7 28.96,20.83 | v29.34,32.13 29.59,32.38 | v36.7,31.75 36.45,32 | v33.27,32.13 33.27,32.26 33.4,32.38
  pour Bottom: 0.38,75.56 99.82,75.56 99.82,0.51 0.25,0.51 0.25,18.29
AVCC  (2 unrouted)
  Top 0.305: DAC.5 59.19,30.59 59.56,30.23 59.56,28.49 C43.1 | DAC.41 53.69,36.56 | 53.69,36.56 C45.1 | DAC.44 52.82,35.06 52.68,35.06 | C47.2 C49.2 | DAC.45 54.25,34.56 53.72,34.04 53.72,32.55 C44.1 | DAC.40 54.5,37.06 54.36,37.21 54.36,37.68 C48.2 | DAC.32 59.19,43 C46.1 | 53.69,36.56 53.48,36.56
  Top 1.016: 52.83,35.05 52.82,35.06 53.43,35.67 C45.1 C50.2 53.43,40.81 51.56,42.67 51.56,44.58 52.32,45.34 56.86,45.34 C46.1 58.13,44.07 | 53.48,36.56 53.47,36.58 | 58.63,27.56 C43.1 58.67,27.56 57.53,26.42 54.1,26.42 52.2,28.32 52.2,30.35 52.7,30.86 52.7,31.54 C44.1 | 52.68,35.06 52.79,34.95 C44.1 | C44.1 52.79,31.58
DAC_RST  (via drill 0.6)
  Top 0.305: DAC.9 61.19,29.99 v61.21,29.97 | R41.1 62.19,24.93 v61.21,25.91
  Bottom 0.305: v61.21,29.97 v61.21,25.91
GND
  Top 0.305: C52.2 C51.2 67.72,36.56 DAC.20
  pour Top: 59.69,30.99 59.69,44.83 44.7,56.13 47.24,63.63 83.82,63.75 84.58,20.57 62.36,20.57 59.94,26.92 59.94,30.61
N$1
  Top 0.508: R9.1 39.38,22.86 C12.-
N$2
  Top 0.508: R10.1 39.13,28.57 C13.-
N$3
  Top 0.508: R1.1 39.26,4.19 C2.-
N$4
  Top 0.508: R2.1 39,9.91 C3.-
N$5
  Top 0.508: R4.1 35.31,8 | 35.31,8 36.77,8 C4.2 | 35.31,8 35.22,8.09 R2.2 35.22,11.43 R5.2
N$6
  Top 0.508: C4.1 35.31,6.16 | 35.31,6.16 34.82,6.16 R3.1 | 35.31,6.16 35.22,6.07 R1.2 35.18,4.15 35.18,1.91 34.04,0.76 31.62,0.76 30.99,1.4 R6.1
N$7
  Top 0.508: R12.1 35.43,26.67 | 35.43,26.67 36.9,26.67 C14.2 | 35.43,26.67 35.34,26.76 R10.2 35.34,30.1 R13.2
N$8
  Top 0.508: IC1.3 32.55,7.49 R4.2 33.06,10.06 C9.1
N$9
  Top 0.508: IC1.2 R3.2 33.06,4.29 C10.2
N$10
  Top 0.508: R7.1 27.18,7.49 | 27.18,7.49 IC1.6 | C10.1 31.9,2.35 R6.2 30.44,3.81 29.08,3.81 27.18,5.71 27.18,7.49
N$11
  Top 0.508: C14.1 35.43,24.83 | 35.43,24.83 34.95,24.83 R11.1 | 35.43,24.83 35.34,24.74 R9.2 35.31,22.82 35.31,20.57 34.16,19.43 31.75,19.43 31.11,20.07 R14.1
N$12
  Top 0.406: R7.2 9.42,12.03 OUT1.T
N$13
  Top 0.508: IC2.3 32.68,26.16 R12.2 33.19,28.73 C19.1
N$14
  Top 0.508: IC2.2 R11.2 33.19,22.96 C20.2
N$15
  Top 0.508: R15.1 27.3,26.16 | 27.3,26.16 IC2.6 | C20.1 32.03,21.02 R14.2 30.57,22.48 29.21,22.48 27.3,24.38 27.3,26.16
N$16  (via drill 0.6)
  Top 0.406: R15.2 20.87,30.7 v20.7,30.86
  Bottom 0.406: v20.7,30.86 9.38,30.86 OUT2.T
N$17
  Top 0.508: R17.1 39.38,41.53 C22.-
N$18
  Top 0.508: R18.1 39.13,47.24 C23.-
N$19
  Top 0.508: R20.1 35.43,45.34 | 35.43,45.34 36.9,45.34 C24.2 | 35.43,45.34 35.34,45.43 R18.2 35.34,48.77 R21.2
N$20
  Top 0.508: C24.1 35.43,43.5 | 35.43,43.5 34.95,43.5 R19.1 | 35.43,43.5 35.34,43.41 R17.2 35.31,41.49 35.31,39.24 34.16,38.1 31.75,38.1 31.11,38.73 R22.1
N$21
  Top 0.508: IC3.3 32.68,44.83 R20.2 33.19,47.4 C29.1
N$22
  Top 0.508: IC3.2 R19.2 33.19,41.63 C30.2
N$23
  Top 0.508: R23.1 27.3,44.83 | 27.3,44.83 IC3.6 | C30.1 32.03,39.69 R22.2 30.57,41.15 29.21,41.15 27.3,43.05 27.3,44.83
N$24  (via drill 0.6)
  Top 0.406: R23.2 20.74,49.36 v20.7,49.4
  Bottom 0.406: v20.7,49.4 9.51,49.4 OUT3.T
N$25
  Top 0.508: R25.1 39.38,60.45 C32.-
N$26
  Top 0.508: R26.1 39.13,66.17 C33.-
N$27
  Top 0.508: R28.1 35.43,64.26 | 35.43,64.26 36.9,64.26 C34.2 | 35.43,64.26 35.34,64.35 R26.2 35.34,67.69 R29.2
N$28
  Top 0.508: C34.1 35.43,62.42 | 35.43,62.42 34.95,62.42 R27.1 | 35.43,62.42 35.34,62.34 R25.2 35.31,60.41 35.31,58.17 34.16,57.02 31.75,57.02 31.11,57.66 R30.1
N$29
  Top 0.508: IC4.3 32.68,63.75 R28.2 33.19,66.32 C39.1
N$30
  Top 0.508: IC4.2 R27.2 33.19,60.55 C40.2
N$31
  Top 0.508: R31.1 27.3,63.75 | 27.3,63.75 IC4.6 | C40.1 32.03,58.61 R30.2 30.57,60.07 29.21,60.07 27.3,61.98 27.3,63.75
N$32  (via drill 0.6)
  Top 0.406: v20.57,68.33 27.27,68.33 R31.2
  Bottom 0.406: v20.57,68.33 9.51,68.33 OUT4.T
N$33
  Top 0.305: DAC.48 55.88,33.03 55.88,32.38 56.26,32 56.26,30.99 55.46,30.19 C41.2
N$34
  Top 0.305: DAC.37 54.91,38.56 54.74,38.73 54.74,41.82 C42.2
N$35
  Top 0.305: DAC.21 65.77,37.06 66.29,37.59 66.29,38.61 66.8,39.12 70.36,39.12 JP1.2
N$36
  Top 0.305: DAC.22 65.38,37.56 65.79,37.97 65.79,38.86 66.55,39.62 68.33,39.62 JP1.4
N$37
  Top 0.305: DAC.23 65.11,38.06 65.28,38.23 65.28,39.12 JP1.6
N$38
  Top 0.305: DAC.24 64.04,40.42 JP1.8
N$39
  Top 0.305: DAC.14 65.11,33.56 65.28,33.4 65.28,25.78 JP2.2
N$40
  Top 0.305: DAC.15 65.5,34.06 65.79,33.78 65.79,27.81 66.17,27.43 JP2.4
N$41
  Top 0.305: DAC.16 65.89,34.56 66.29,34.16 66.29,29.84 JP2.6
N$42
  Top 0.305: DAC.17 66.16,35.06 66.8,34.42 66.8,31.88 JP2.8
N$43
  Top 0.305: DAC.18 66.67,35.56 67.69,34.54 67.69,33.53 JP2.10
N$44
  Top 0.305: DAC.29 60.69,43.32 57.78,46.23 50.55,46.23 49.4,47.37 49.4,48.13 | SW1.1 49.4,48.13 | R42.1 49.36,48.17 49.4,48.13
N$45
  Top 0.305: DAC.28 61.19,43.58 58.04,46.74 52.45,46.74 51.94,47.24 51.94,48.01 | 51.94,48.01 SW1.2 | R40.1 51.78,48.17 51.94,48.01
N$46
  Top 0.305: DAC.27 61.69,43.97 58.29,47.37 54.86,47.37 54.48,47.75 54.48,48.39 | 54.48,48.39 SW1.3 | R39.1 54.4,48.3 54.48,48.39
N$47
  Top 0.305: DAC.26 62.19,44.23 58.42,48.01 57.66,48.01 57.02,48.64 SW1.4 57.02,53.09 55.24,54.86 49.06,54.86 R38.1
N$48
  Top 0.305: DAC.25 62.69,44.49 58.8,48.39 58.8,49.19 R37.1 58.59,51.47 SW1.5
N$49  (via drill 0.6)
  Top 0.305: DAC.11 62.19,34.45 v61.59,35.05 | SW1.6 v62.1,46.23 62.61,45.72 R36.1
  Bottom 0.305: v61.59,35.05 61.59,45.72 v62.1,46.23
N$50  (via drill 0.6)
  Top 0.305: DAC.12 62.69,35.73 v62.36,36.07 | SW1.7 64.26,52.07 v64.26,46.86 65.19,46.86 R35.1
  Bottom 0.305: v62.36,36.07 62.36,44.96 v64.26,46.86
N$51  (via drill 0.6)
  Top 0.305: DAC.10 61.69,33.43 v60.83,34.29 | SW1.8 67.18,50.25 R34.1
  Bottom 0.305: v60.83,34.29 60.83,37.47 60.96,37.59 60.96,46.35 63.75,49.15 63.88,49.15 SW1.8
N$52  (via drill 0.6)
  Top 0.305: DAC.8 60.69,33.16 v59.69,34.16 | SW1.9 69.72,49.49 R33.1
  Bottom 0.305: v59.69,34.16 59.69,37.34 60.33,37.97 60.33,46.48 63.37,49.53 63.37,53.98 63.75,54.36 67.82,54.36 SW1.9
OUT1+  (via drill 0.6)
  Top 0.305: v50.8,7.87 48.55,7.87 R8.1 | DAC.1 57.19,30.65 56.64,30.1 56.64,29.08 v57.02,28.7
  Top 0.508: R8.1 46.74,7.83 C1.2 46.61,8.62 C3.+
  Bottom 0.305: v57.02,28.7 57.02,13.34 51.56,7.87 v50.8,7.87
OUT1-  (via drill 0.6)
  Top 0.305: DAC.2 57.69,30.01 v57.4,29.72 | v50.55,6.1 48.55,6.1 R8.2
  Top 0.508: C2.+ 46.61,5.73 C1.1 48.39,6.01 R8.2
  Bottom 0.305: v57.4,29.72 57.4,29.59 57.91,29.08 57.91,28.07 57.53,27.69 57.53,13.08 v50.55,6.1
OUT2+  (via drill 0.6)
  Top 0.305: DAC.47 54.9,33.56 54.74,33.4 54.74,32.13 v55.37,31.5 | R16.1 48.68,26.54 v49.91,26.54
  Top 0.508: R16.1 46.86,26.5 C11.2 46.74,27.29 C13.+
  Bottom 0.305: v49.91,26.54 51.31,26.54 55.37,30.61 v55.37,31.5
OUT2-  (via drill 0.6)
  Top 0.305: DAC.46 54.64,34.06 54.23,33.66 v54.23,31.37 | 48.68,24.77 R16.2 50.33,24.8 50.8,25.27 v50.8,27.43
  Top 0.508: C12.+ 46.74,24.4 C11.1 48.51,24.68 R16.2
  Bottom 0.305: v50.8,27.43 50.8,27.94 v54.23,31.37
OUT3+  (via drill 0.6)
  Top 0.305: DAC.38 57.11,38.06 v57.28,38.23 | v50.04,45.09 48.73,45.09 R24.1
  Top 0.508: R24.1 46.86,45.17 C21.2 46.74,45.96 C23.+
  Bottom 0.305: v57.28,38.23 57.28,38.73 57.02,38.99 57.02,39.62 54.86,41.78 53.34,41.78 v50.04,45.09
OUT3-  (via drill 0.6)
  Top 0.305: DAC.39 56.8,37.56 v57.4,36.96 | v50.04,43.43 48.68,43.43 R24.2
  Top 0.508: C22.+ 46.74,43.07 C21.1 48.51,43.35 R24.2
  Bottom 0.305: v57.4,36.96 56.77,37.59 55.88,37.59 v50.04,43.43
OUT4+  (via drill 0.6)
  Top 0.305: 57.19,40.09 DAC.36 55.5,41.61 v55.5,42.42 | R32.1 49.7,64.1 v50.16,63.63
  Top 0.508: R32.1 46.86,64.1 C31.2 46.74,64.88 C33.+
  Bottom 0.305: v50.16,63.63 50.16,62.1 50.67,61.59 54.99,61.59 55.5,61.09 v55.5,42.42
OUT4-  (via drill 0.6)
  Top 0.305: DAC.35 57.69,41.11 57.53,41.27 57.28,41.27 v56.64,41.91 | v51.31,62.36 48.68,62.36 R32.2
  Top 0.508: C32.+ 46.74,61.99 C31.1 48.51,62.27 R32.2
  Bottom 0.305: v56.64,41.91 56.52,42.04 56.52,42.55 56.01,43.05 56.01,61.72 55.37,62.36 v51.31,62.36